# Altium schematic sheet Resistor - 178-213.SchDoc
size A0; SheetNumber: 5; SheetTotal: 41
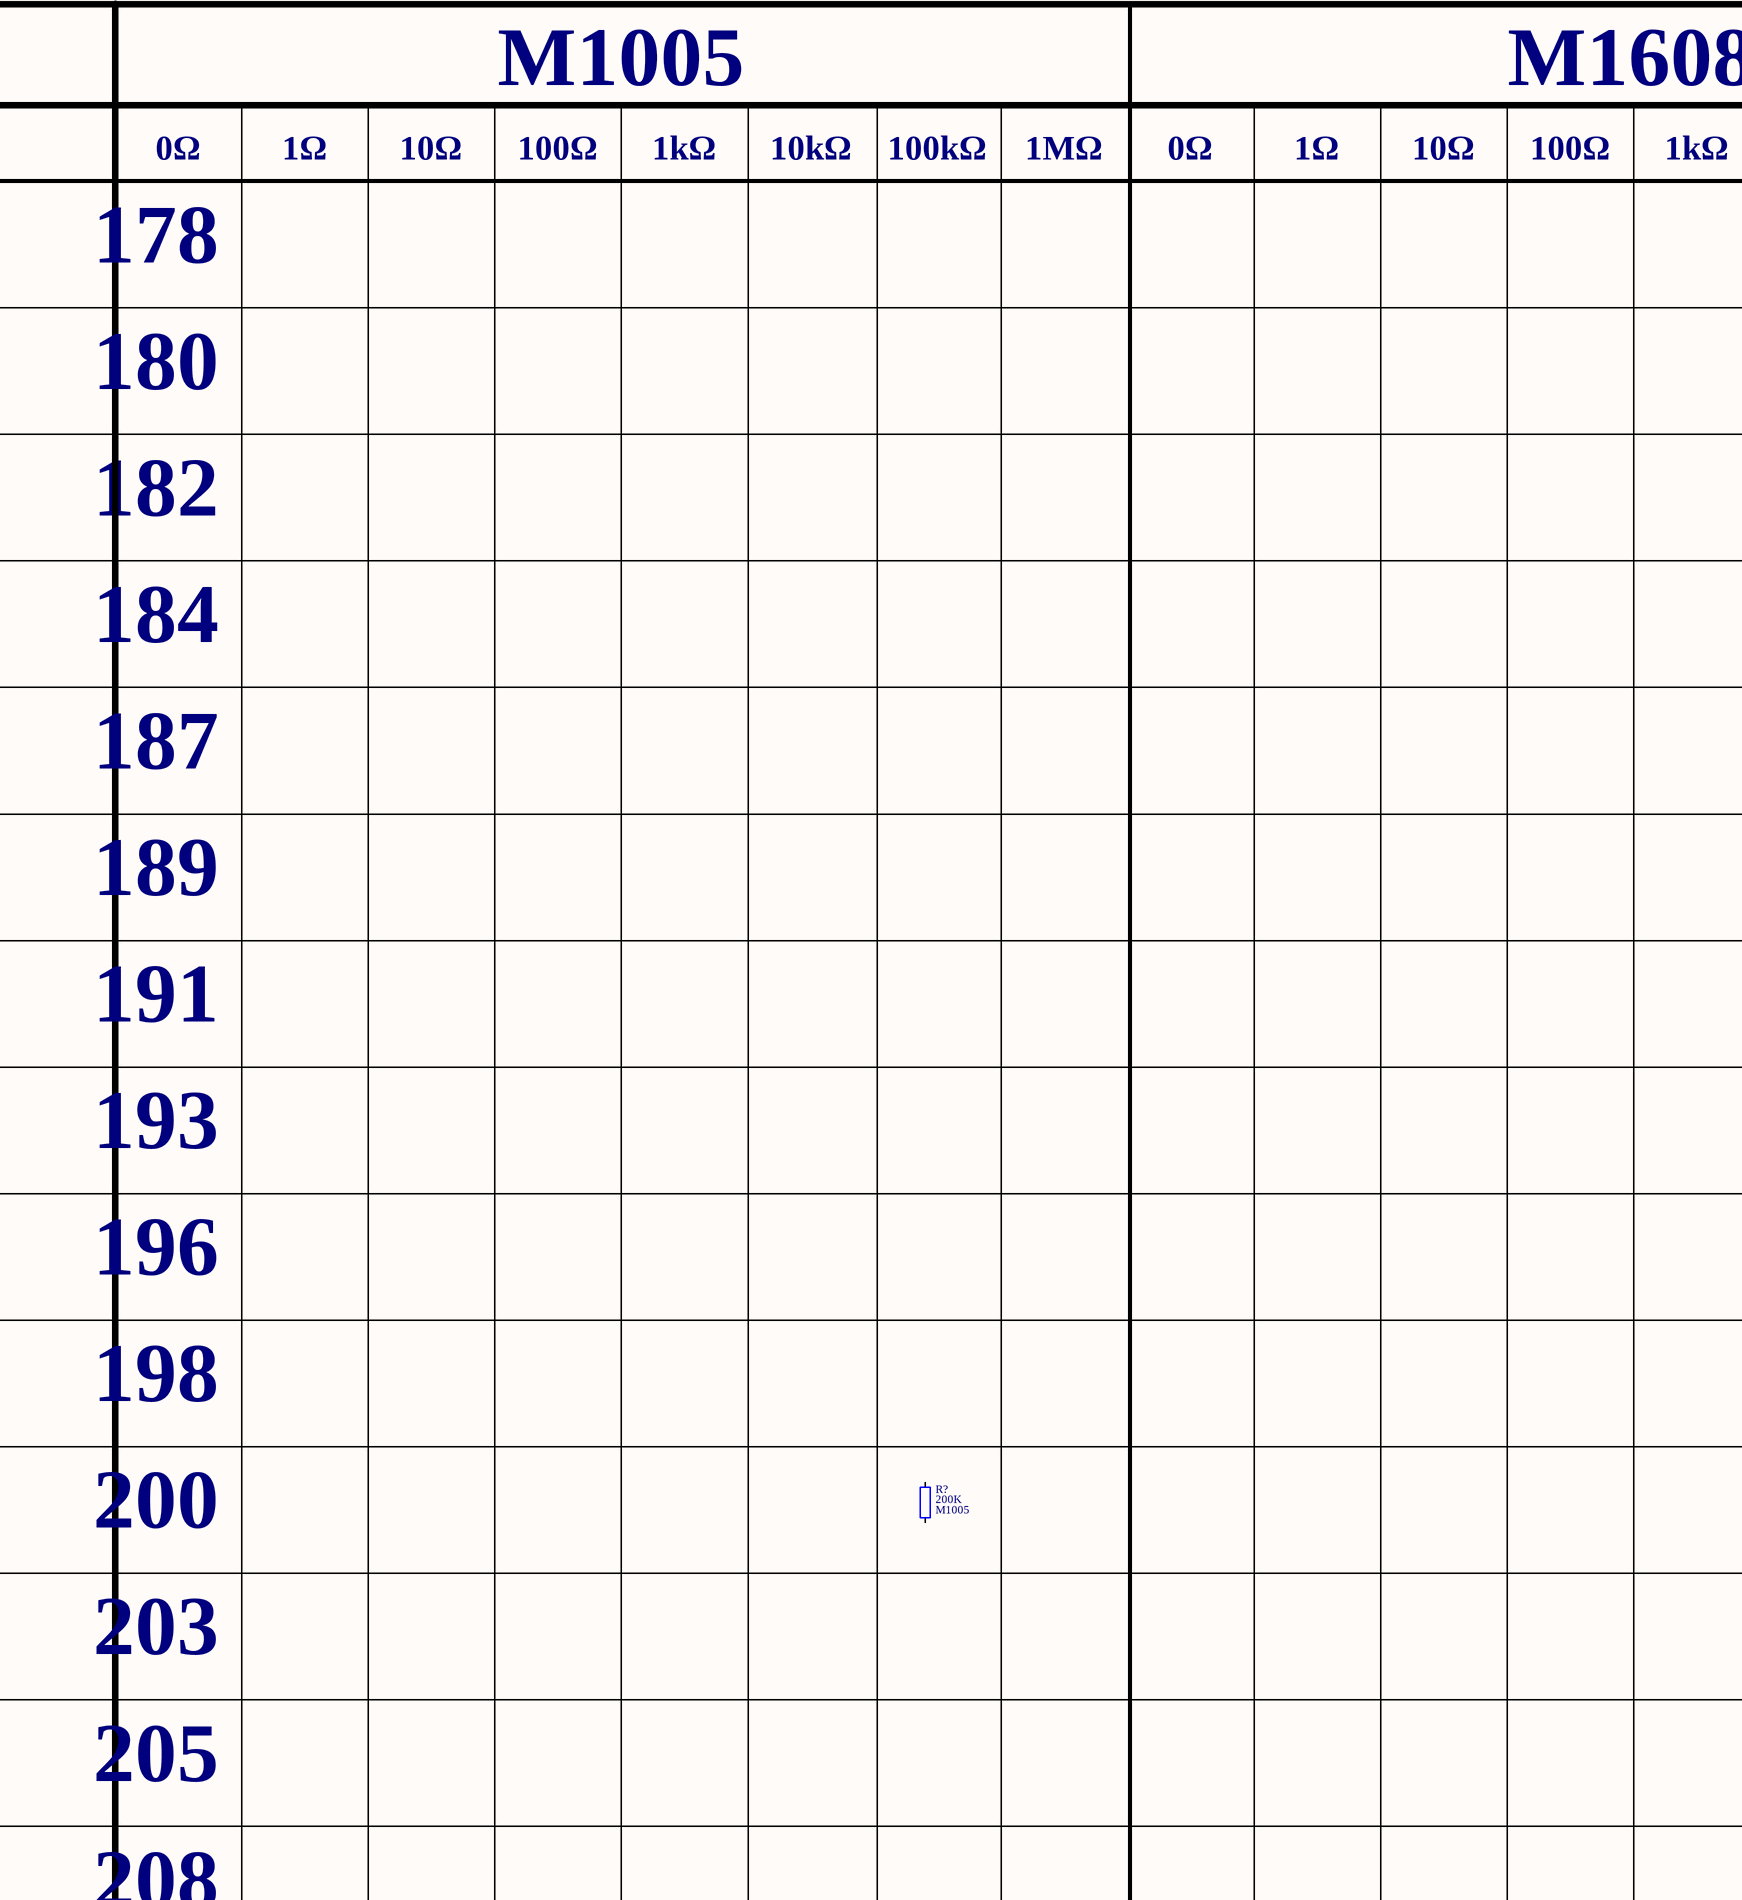
[diagram p0: Resistor - 178-213.SchDoc, top left]
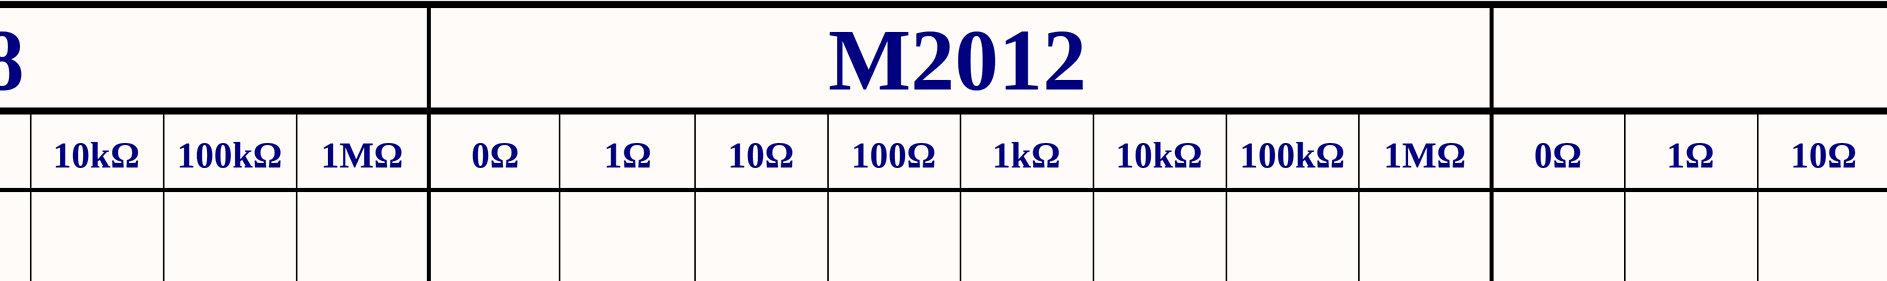
[diagram p1: Resistor - 178-213.SchDoc, top middle]
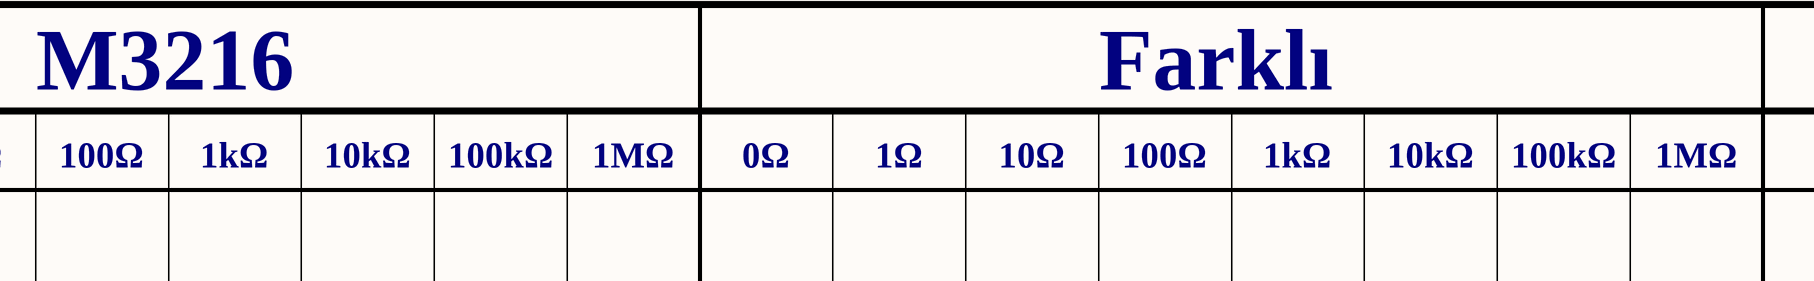
[diagram p2: Resistor - 178-213.SchDoc, top right]
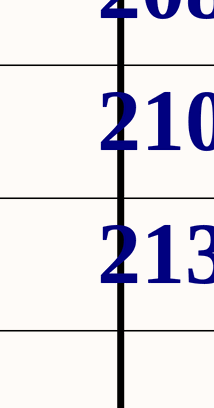
[diagram p3: Resistor - 178-213.SchDoc, bottom left]

## Parts
R?  value 200K  Package: M1005  [Resistor_Smd_M1005_I0402]  (hidden comment: Resistor)

## Nets

Not connected (* = marked no-connect by the designer): R? 1 2

## Notes on the sheet
- M1005
- M1608
- M2012
- M3216
- Farklı
- 0Ω
- 1Ω
- 10Ω
- 100Ω
- 1kΩ
- 10kΩ
- 100kΩ
- 1MΩ
- 178
- 180
- 182
- 184
- 187
- 189
- 191
- 193
- 196
- 198
- 200
- 203
- 205
- 208
- 210
- 213

## Library data of the parts
R? = Resistor: Res, 200K, 1%, M1005; Manufacturer: Yageo; Manufacturer Part Number: RC0402FR-07200KL; Component Category: Resistor; Component Type: Fixed Value; Tolerance: 1%; Supplier Link: https://www.digikey.com/en/products/detail/yageo/RC0402FR-07200KL/726558; Supplier Currency: $; Price, Max: 0.00129; Price, Min: 0.1; Quantity, Max: 100000; Quantity, Min: 1; Operating Temperature, Max: -55℃; Operating Temperature, Min: +155℃; Supplier Part Number: 311-200KLRCT-ND; Supplier: Digikey; ComponentLink1Description: Datasheet; ComponentLink1URL: E:\Altium\Datasheets\Resistor\Yageo - RC_L Series.pdf; ComponentLink2Description: Supplier Link; ComponentLink2URL: https://www.digikey.com/en/products/detail/yageo/RC0402FR-07200KL/726558